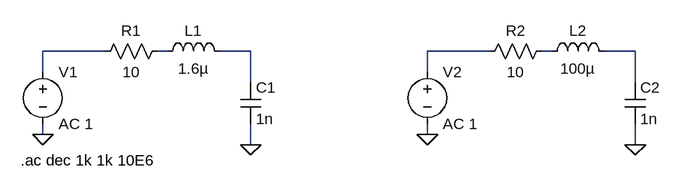
[diagram p0: schematic CM_INPUT_FILTER.asc]
CM_INPUT_FILTER.asc, the LTspice schematic file:
Version 4
SHEET 1 968 680
WIRE 112 96 16 96
WIRE 208 96 192 96
WIRE 336 96 288 96
WIRE 704 96 608 96
WIRE 800 96 784 96
WIRE 928 96 880 96
WIRE 16 128 16 96
WIRE 608 128 608 96
WIRE 336 144 336 96
WIRE 928 144 928 96
WIRE 16 224 16 208
WIRE 608 224 608 208
WIRE 336 240 336 208
WIRE 928 240 928 208
FLAG 16 224 0
FLAG 336 240 0
FLAG 608 224 0
FLAG 928 240 0
SYMBOL voltage 16 112 R0
WINDOW 123 0 0 Left 0
WINDOW 39 0 0 Left 0
SYMATTR InstName V1
SYMATTR Value AC 1
SYMBOL ind 192 112 R270
WINDOW 0 32 56 VTop 2
WINDOW 3 5 56 VBottom 2
SYMATTR InstName L1
SYMATTR Value 1.6µ
SYMBOL cap 320 144 R0
SYMATTR InstName C1
SYMATTR Value 1n
SYMBOL res 208 80 R90
WINDOW 0 0 56 VBottom 2
WINDOW 3 32 56 VTop 2
SYMATTR InstName R1
SYMATTR Value 10
SYMBOL voltage 608 112 R0
WINDOW 123 0 0 Left 0
WINDOW 39 0 0 Left 0
SYMATTR InstName V2
SYMATTR Value AC 1
SYMBOL ind 784 112 R270
WINDOW 0 32 56 VTop 2
WINDOW 3 5 56 VBottom 2
SYMATTR InstName L2
SYMATTR Value 100µ
SYMBOL cap 912 144 R0
SYMATTR InstName C2
SYMATTR Value 1n
SYMBOL res 800 80 R90
WINDOW 0 0 56 VBottom 2
WINDOW 3 32 56 VTop 2
SYMATTR InstName R2
SYMATTR Value 10
TEXT -18 264 Left 2 !.ac dec 1k 1k 10E6

The netlist it stands for:
* CM_INPUT_FILTER.asc
V1 N001 0 AC 1
L1 N002 N003 1.6µ
C1 N003 0 1n
R1 N002 N001 10
V2 N004 0 AC 1
L2 N005 N006 100µ
C2 N006 0 1n
R2 N005 N004 10
.ac dec 1k 1k 10E6
.backanno
.end